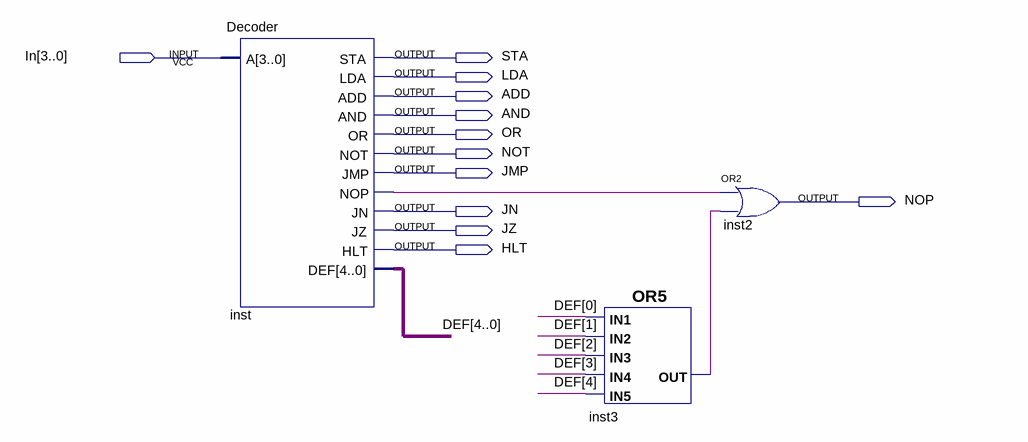
[diagram p0: schematic sheet]
// Quartus schematic DECOD.bdf as structural Verilog: 3 symbols, 12 pins
module DECOD (
  input  [3:0] In,
  output STA,
  output LDA,
  output ADD,
  output AND,
  output OR,
  output NOT,
  output JMP,
  output NOP,
  output JN,
  output JZ,
  output HLT
);

  wire inst3_out, inst_nop;
  wire [4:0] DEF;

  Decoder inst (
    .A(In), .STA(STA), .LDA(LDA), .ADD(ADD), .AND(AND), .OR(OR), .NOT(NOT), .JMP(JMP), .NOP(inst_nop),
    .JN(JN), .JZ(JZ), .HLT(HLT), .DEF(DEF));
  or inst3 (inst3_out, DEF[0], DEF[1], DEF[2], DEF[3], DEF[4]);
  or inst2 (NOP, inst_nop, inst3_out);
endmodule
